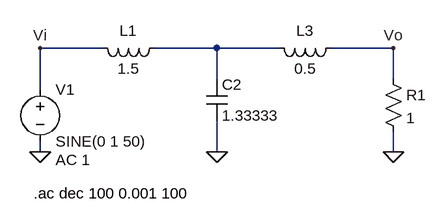
[diagram p0: schematic TPS6_2.asc]
TPS6_2.asc, the LTspice schematic file:
Version 4
SHEET 1 880 680
WIRE 32 112 -64 112
WIRE 208 112 112 112
WIRE 304 112 208 112
WIRE 480 112 384 112
WIRE 208 160 208 112
WIRE 480 160 480 112
WIRE -64 176 -64 112
WIRE -64 272 -64 256
WIRE 208 272 208 224
WIRE 480 272 480 240
FLAG 208 272 0
FLAG 480 272 0
FLAG -64 112 Vi
FLAG 480 112 Vo
FLAG -64 272 0
SYMBOL ind 128 96 R90
WINDOW 0 5 56 VBottom 2
WINDOW 3 32 56 VTop 2
SYMATTR InstName L1
SYMATTR Value 1.5
SYMBOL cap 192 160 R0
SYMATTR InstName C2
SYMATTR Value 1.33333
SYMBOL ind 400 96 R90
WINDOW 0 5 56 VBottom 2
WINDOW 3 32 56 VTop 2
SYMATTR InstName L3
SYMATTR Value 0.5
SYMBOL res 464 144 R0
SYMATTR InstName R1
SYMATTR Value 1
SYMBOL voltage -64 160 R0
WINDOW 123 24 124 Left 2
WINDOW 39 0 0 Left 0
SYMATTR InstName V1
SYMATTR Value SINE(0 1 50)
SYMATTR Value2 AC 1
TEXT -74 336 Left 2 !.ac dec 100 0.001 100

The netlist it stands for:
* TPS6_2.asc
L1 N001 Vi 1.5
C2 N001 0 1.33333
L3 Vo N001 0.5
R1 Vo 0 1
V1 Vi 0 SINE(0 1 50) AC 1
.ac dec 100 0.001 100
.backanno
.end